# EasyEDA Pro project 2025NUEDC_A_Project.eprj, board PCB1_2
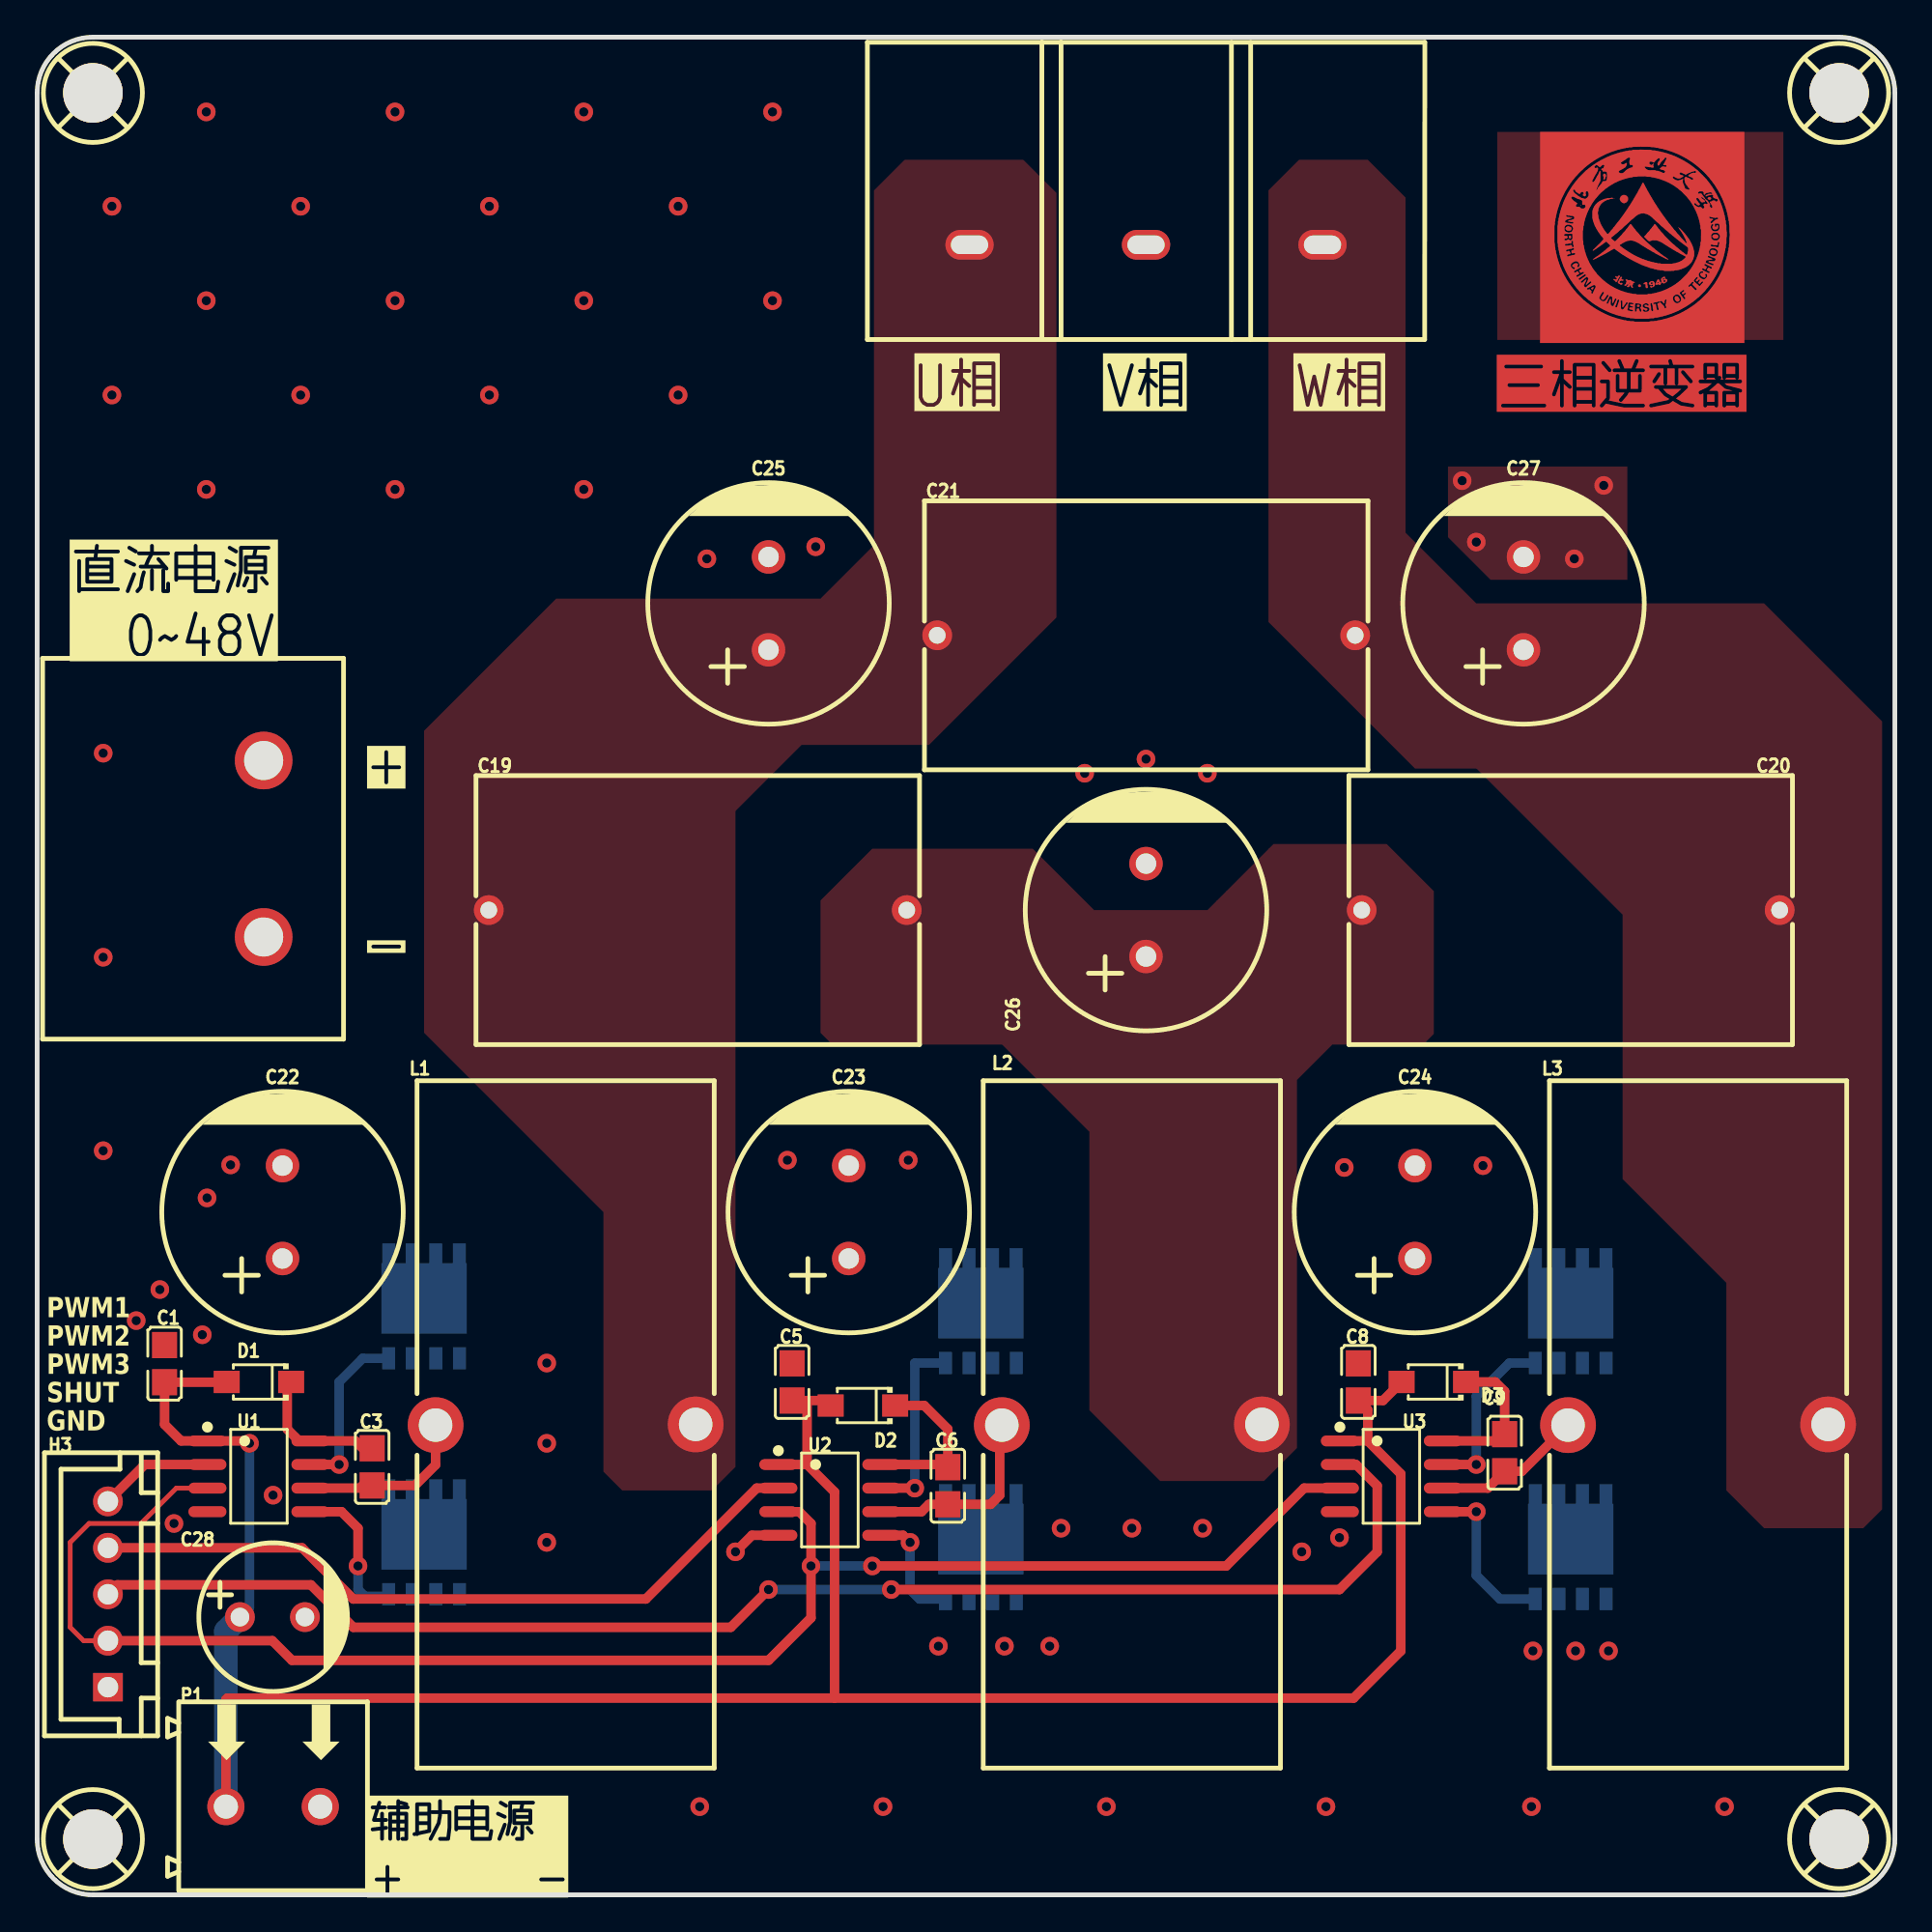
[diagram p5: board, top side]
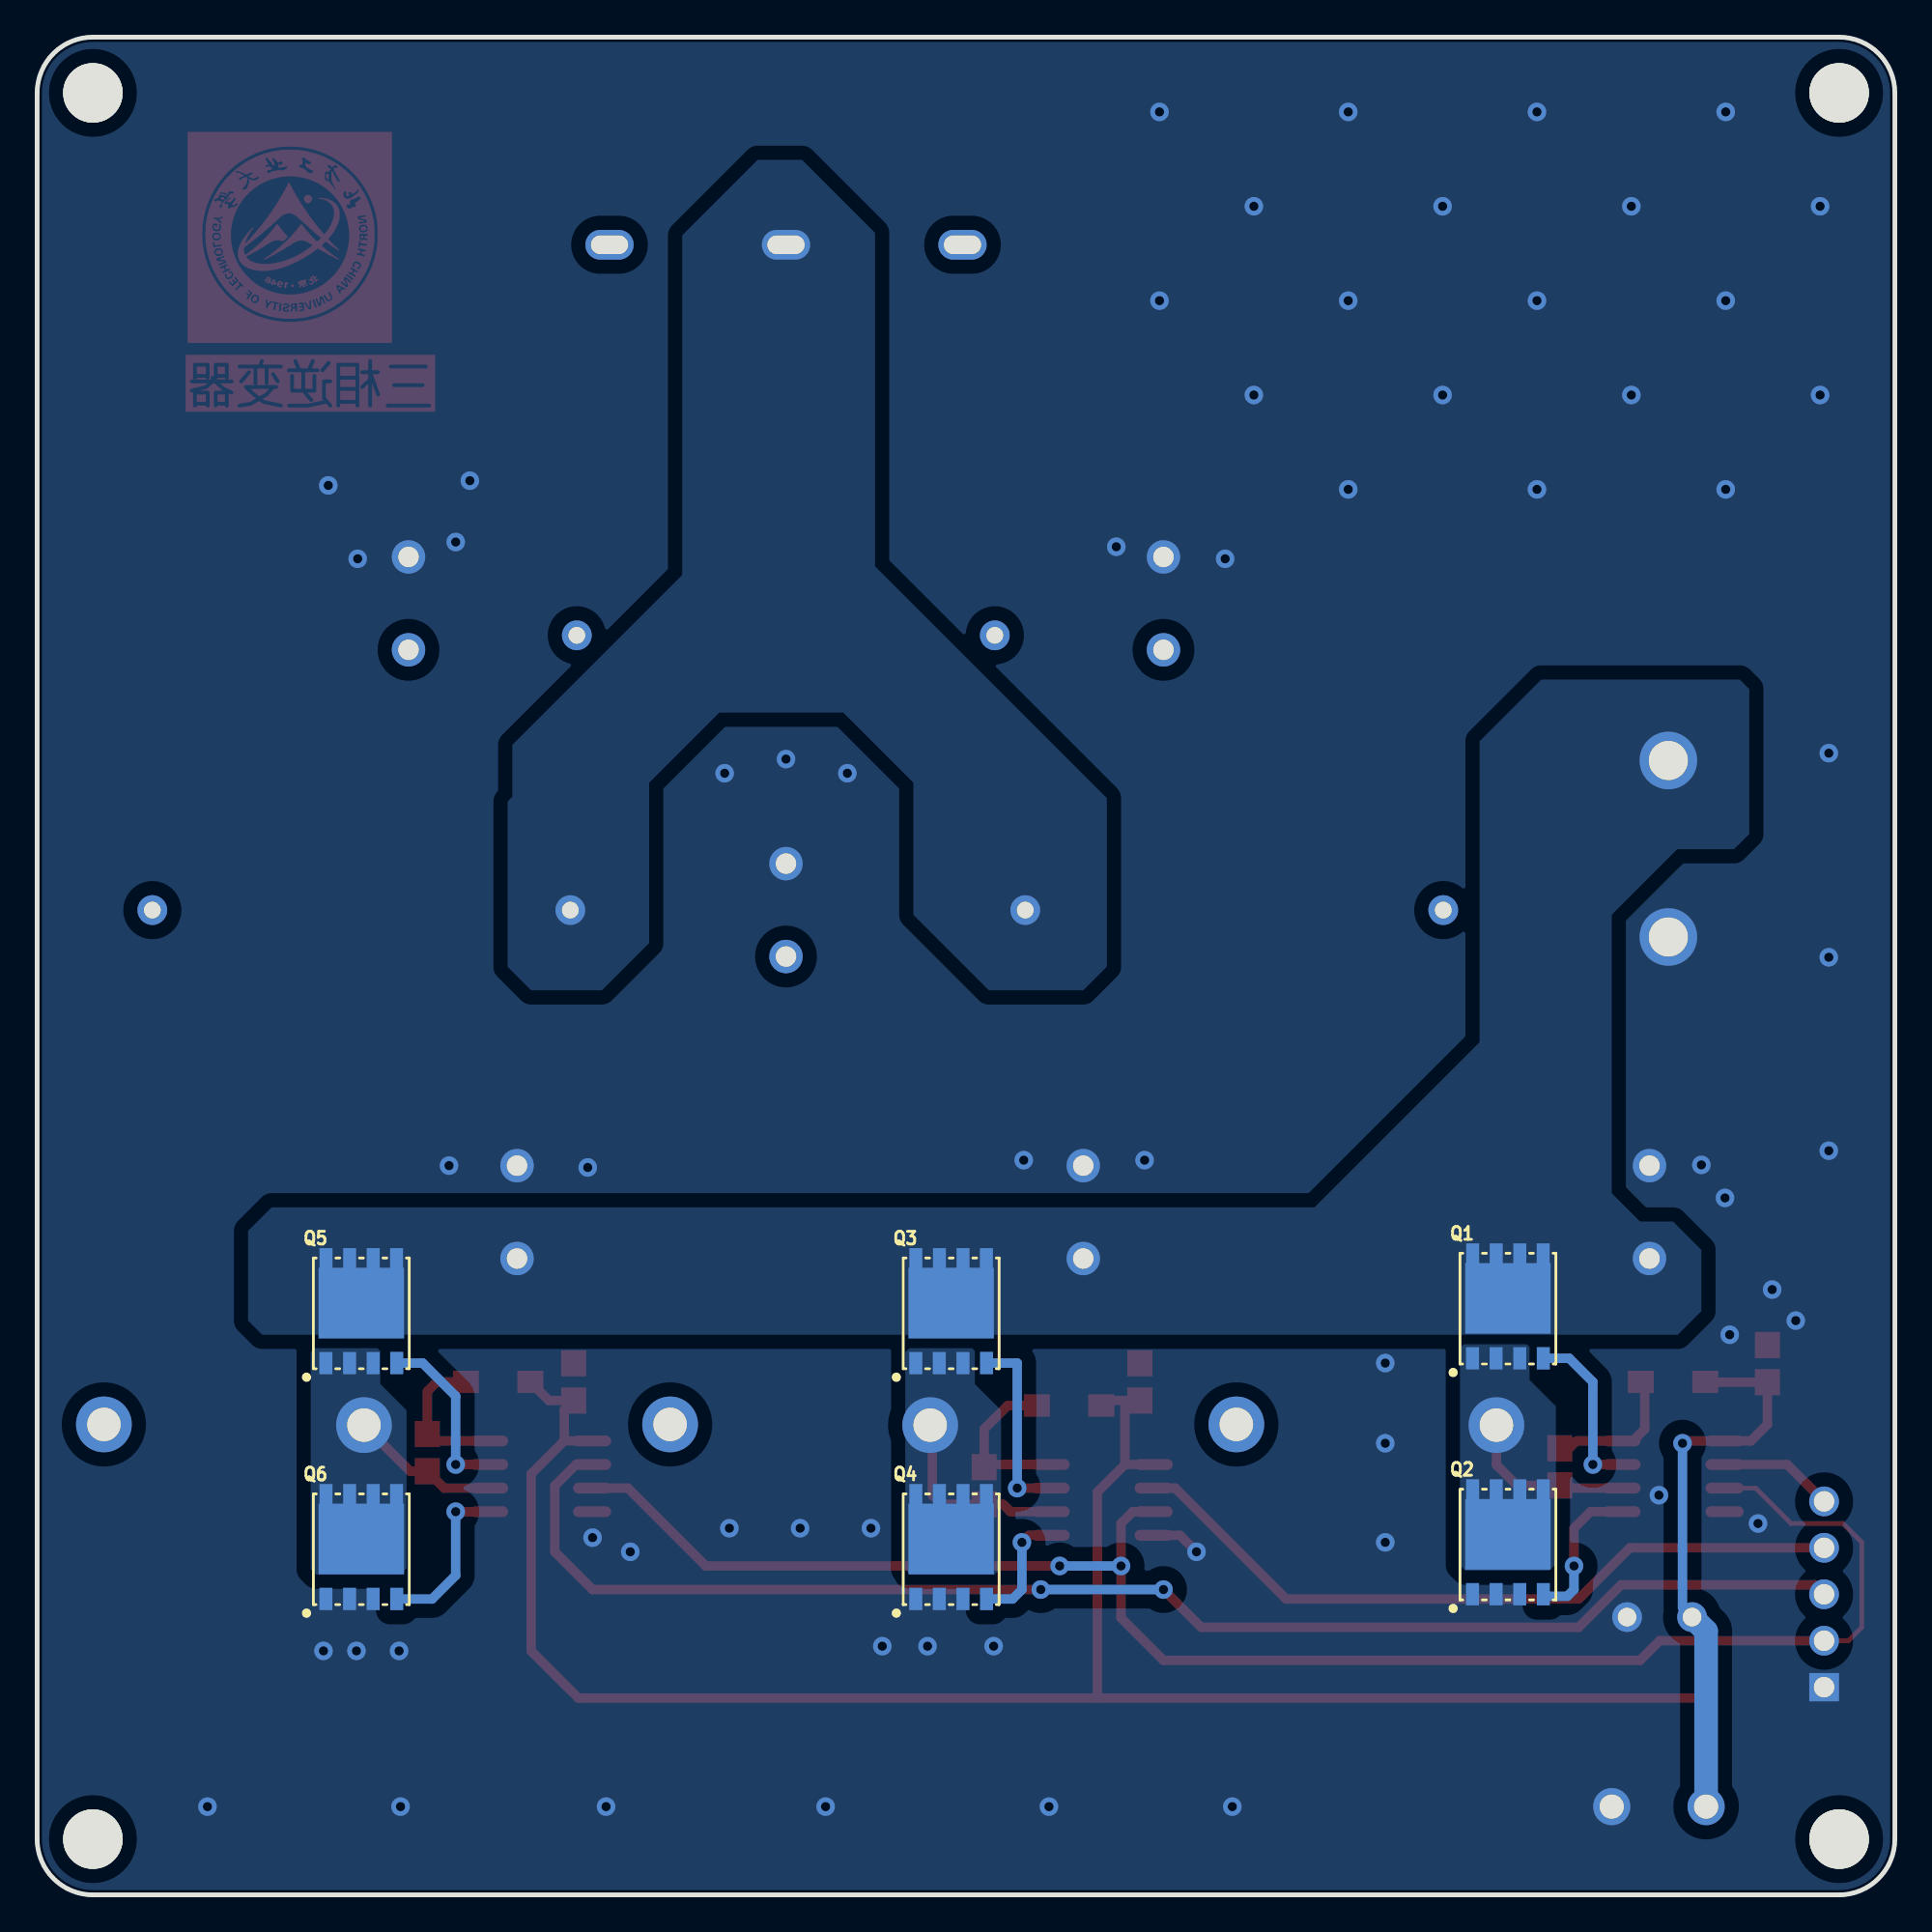
[diagram p6: board, bottom side, seen from below]

Outline 100 x 100 mm; copper layers: Top Layer, Bottom Layer. Coordinates in mm from the lower left corner of the outline.
Outline path: 0,97 0,3 arc(0.88,0.88) 3,0 97,0 arc(99.12,0.88) 100,3 100,97 arc(99.12,99.12) 97,100 3,100 arc(0.88,99.12) 0,97
Stack: Top Layer 0.035mm / Dielectric1 1.51mm FR4 er 4.5 / Bottom Layer 0.035mm

## Design rules (mm)
template: 自定义配置
spacing copperThickness1oz (default): track to track 0.102, other pairs 0 to 0.3
spacing copperThickness2oz: track to track 0.203, other pairs 0.152 to 0.3
track width copperThickness1oz (default): min 0.127, default 0.254, max 2.54
track width copperThickness2oz: min 0.203, default 0.254, max 2.54
differential pair differentialPair (default): width min 0.127, default 0.254, max 2.54; gap min 0.152, default 0.152
via viaSize (default): diameter min 0.5, default 0.61, max 10; hole min 0.3, default 0.305, max 6.299
net GND uses copperRegion1
net V uses copperRegion1

## Placement (name value [footprint] x y rotation side)
C1  10uF  [C0805]  6.86 28.59 270 top
C3  10uF  [C0805]  18.03 23.04 90 top
C5  10uF  [C0805]  40.64 27.61 270 top
C6  10uF  [C0805]  49.02 22.02 90 top
C8  10uF  [C0805]  71.12 27.61 270 top
C9  10uF  [C0805]  78.99 23.8 90 top
C19  4.7uF  [CAP-TH_L24.0-W14.5-P22.5-D0.8]  35.56 53.01 180 top
C20  4.7uF  [CAP-TH_L24.0-W14.5-P22.5-D0.8]  82.55 53.01 180 top
C21  4.7uF  [CAP-TH_L24.0-W14.5-P22.5-D0.8]  59.7 67.8 180 top
C22  470uF  [CAP-TH_BD13.0-P5.00-D0.6-FD]  13.21 36.75 90 top
C23  470uF  [CAP-TH_BD13.0-P5.00-D0.6-FD]  43.69 36.75 90 top
C24  470uF  [CAP-TH_BD13.0-P5.00-D0.6-FD]  74.17 36.75 90 top
C25  470uF  [CAP-TH_BD13.0-P5.00-D0.6-FD]  39.37 69.52 90 top
C26  470uF  [CAP-TH_BD13.0-P5.00-D0.6-FD]  59.69 53.01 90 top
C27  470uF  [CAP-TH_BD13.0-P5.00-D0.6-FD]  80.01 69.52 90 top
C28  220uF  [CAP-TH_BD8.0-P3.50-D0.6-FD]  12.67 14.95 0 top
D1  1N4007W  [SOD-123FL_L2.7-W1.8-LS3.8-RD]  11.94 27.61 180 top
D2  1N4007W  [SOD-123FL_L2.7-W1.8-LS3.8-RD]  44.45 26.34 180 top
D3  1N4007W  [SOD-123FL_L2.7-W1.8-LS3.8-RD]  75.18 27.61 180 top
H1  DBT50G-9.5-3P-BK-P OGC  [CONN-TH_3P-P9.50_DBT50G-9.5-3P]  59.69 88.82 180 top
H2  DBT50G-9.5-2P-BK-P OGC  [CONN-TH_2P-P9.50_DBT50G-9.5-2P]  12.19 56.31 270 top
H3  ZX-XH2.54-5PZZ  [CONN-TH_5P-P2.50_ZX-XH2.54-5PZZ]  3.81 16.18 90 top
L1  470uH  [IND-TH_L33.0-W16.0-P17.00-D1.5]  28.45 25.32 0 top
L2  470uH  [IND-TH_L33.0-W16.0-P17.00-D1.5]  58.93 25.32 0 top
L3  470uH  [IND-TH_L33.0-W16.0-P17.00-D1.5]  89.41 25.32 0 top
P1  WJ500V-5.08-2P  [CONN-TH_2P-P5.00_WJ500V-5.08-2P]  12.7 4.75 0 top
Q1  CJAC13TH06  [PDFN-8_L5.8-W4.9-P1.27-LS6.1-BL]  20.83 31.67 180 bottom
Q2  CJAC13TH06  [PDFN-8_L5.8-W4.9-P1.27-LS6.1-BL]  20.83 18.97 180 bottom
Q3  CJAC13TH06  [PDFN-8_L5.8-W4.9-P1.27-LS6.1-BL]  50.8 31.42 180 bottom
Q4  CJAC13TH06  [PDFN-8_L5.8-W4.9-P1.27-LS6.1-BL]  50.8 18.72 180 bottom
Q5  CJAC13TH06  [PDFN-8_L5.8-W4.9-P1.27-LS6.1-BL]  82.55 31.42 180 bottom
Q6  CJAC13TH06  [PDFN-8_L5.8-W4.9-P1.27-LS6.1-BL]  82.55 18.72 180 bottom
SCREW1  -  [M3螺丝]  3 97 0 top
SCREW2  -  [M3螺丝]  97 97 0 top
SCREW3  -  [M3螺丝]  97 3 0 top
SCREW4  -  [M3螺丝]  3 3 0 top
U1  IR2104STRPBF  [SOIC-8_L4.9-W3.9-P1.27-LS6.0-BL]  11.94 22.53 270 top
U2  IR2104STRPBF  [SOIC-8_L4.9-W3.9-P1.27-LS6.0-BL]  42.67 21.26 270 top
U3  IR2104STRPBF  [SOIC-8_L4.9-W3.9-P1.27-LS6.0-BL]  72.9 22.53 270 top

## Footprints (pads in the part's own frame, mm; a bottom-side part is the same pattern mirrored in y, then rotated)
C0805
  rect 1.41x1.35 smd: 1(-1,0) 2(1,0)
CAP-TH_BD8.0-P3.50-D0.6-FD
  round 1.6 hole 1: 1(-1.75,0) 2(1.75,0)
CAP-TH_BD13.0-P5.00-D0.6-FD
  round 1.8 hole 1.1: 1(-2.5,0) 2(2.5,0)
CAP-TH_L24.0-W14.5-P22.5-D0.8
  round 1.6 hole 0.9: 1(-11.25,0) 2(11.25,0)
CONN-TH_2P-P5.00_WJ500V-5.08-2P
  round 2 hole 1.3: 1(-2.54,0) 2(2.54,0)
CONN-TH_2P-P9.50_DBT50G-9.5-2P
  round 3.1 hole 2.1: 1(-4.75,0) 2(4.75,0)
CONN-TH_3P-P9.50_DBT50G-9.5-3P
  oval 2.6x1.6 hole 2x1: 1(-9.5,0) 2(0,0) 3(9.5,0)
CONN-TH_5P-P2.50_ZX-XH2.54-5PZZ
  rect 1.524x1.6 hole 1.1: 1(-5,0)
  round 1.6 hole 1.1: 2(-2.5,0) 3(0,0) 4(2.5,0) 5(5,0)
IND-TH_L33.0-W16.0-P17.00-D1.5
  round 3 hole 1.8: 1(-7,-0.038) 2(7,0)
M3螺丝
  round 3.2 hole 3.2: 1(0,0)
PDFN-8_L5.8-W4.9-P1.27-LS6.1-BL
  rect 0.7x1.2 smd: 1(-1.905,-2.792) 2(-0.635,-2.792) 3(0.635,-2.792) 4(1.905,-2.792) 5(1.9,2.792) 6(0.64,2.792) 7(-0.63,2.792) 8(-1.9,2.792)
  rect 4.6x3.8 smd: 9(0,0.432)
SOD-123FL_L2.7-W1.8-LS3.8-RD
  rect 1.4x1.2 smd: 1(-1.735,0) 2(1.735,0)
SOIC-8_L4.9-W3.9-P1.27-LS6.0-BL
  oval 0.588x2.045 smd: 1(-1.905,-2.772) 2(-0.635,-2.772) 3(0.635,-2.772) 4(1.905,-2.772) 5(1.905,2.772) 6(0.635,2.772) 7(-0.635,2.772) 8(-1.905,2.772)

## Nets
As in the schematic.

Pads without a net: SCREW1 1; SCREW2 1; SCREW3 1; SCREW4 1

## Via types
v1: diameter 1, hole 0.5, Top Layer to Bottom Layer, 74 vias

## Routing (per net, layer and track width the routed paths; a pad name or vN(x,y) marks a point on that pad's centre or on a via; arc(x,y) is an arc through that point)
GND: length 2.7
  Top Layer w0.508: v1(37.59,18.47) 38.48,19.35 U2.4
  vias: v1(3.56,61.46) v1(3.56,50.47) v1(3.56,40.06) v1(4.02,90.9) v1(4.02,80.74) v1(5.33,30.91) v1(6.6,32.58) v1(7.37,19.99) v1(8.89,30.15) v1(9.1,95.98) v1(9.1,85.82) v1(9.1,75.66) v1(9.14,37.52) v1(10.41,39.29) v1(12.7,21.51) v1(14.18,90.9) v1(14.18,80.74) v1(19.26,95.98) v1(19.26,85.82) v1(19.26,75.66) v1(24.34,90.9) v1(24.34,80.74) v1(27.43,28.63) v1(27.43,24.31) v1(27.43,18.97) v1(29.42,95.98) v1(29.42,85.82) v1(29.42,75.66) v1(34.5,90.9) v1(34.5,80.74) v1(35.66,4.75) v1(36.05,71.92) v1(39.58,95.98) v1(39.58,85.82) v1(40.39,39.55) v1(41.91,72.57) v1(45.53,4.75) v1(46.89,39.55) v1(48.51,13.39) v1(52.07,13.39) v1(54.51,13.39) v1(55.12,19.74) v1(56.39,60.38) v1(57.56,4.75) v1(58.93,19.74) v1(59.69,61.14) v1(62.74,19.74) v1(62.99,60.38) v1(68.07,18.47) v1(69.38,4.75) v1(70.1,19.23) v1(70.36,39.15) v1(76.71,76.12) v1(77.47,72.82) v1(77.83,39.25) v1(80.44,4.75) v1(80.52,13.13) v1(82.75,71.92) v1(82.81,13.13) v1(84.33,75.87) v1(84.59,13.13) v1(90.83,4.75)
AUXP: length 140.6
  Top Layer w0.508: C5.2 41.51,26.61 ; 41.51,26.61 42.44,26.61 42.72,26.34 ; 41.51,26.61 41.44,26.55 41.44,23.16 ; 39.14,23.16 41.44,23.16 ; 41.44,23.16 42.93,21.68 42.93,10.59 ; v1(11.43,24.31) 11.3,24.44 U1.1 7.75,24.44 6.86,25.32 C1.2 10.19,27.59 D1.2 ; 42.93,10.59 70.87,10.59 73.41,13.13 73.41,22.66 71.63,24.44 ; 42.93,10.59 10.24,10.59 10.16,10.51 P1.1 ; 71.63,24.44 71.63,26.1 C8.2 72.45,26.61 D3.2 ; 71.63,24.44 U3.1
  Bottom Layer w0.508: v1(11.43,24.31) 11.43,15.47 C28.1
  Bottom Layer w1.27: P1.1 10.16,14.2 C28.1
BST1: length 7.1
  Top Layer w0.508: 17.53,24.04 17.13,24.44 U1.8 14.1,24.44 13.46,25.07 13.46,27.4 D1.1
BST2: length 9
  Top Layer w0.508: U2.8 48.88,23.16 C6.2 49.02,25.07 47.75,26.34 D2.1
BST3: length 8.1
  Top Layer w0.508: U3.8 78.63,24.44 C9.2 78.99,27.1 78.49,27.61 D3.1
HO1: length 9.2
  Top Layer w0.508: U1.7 v1(16.26,23.16)
  Bottom Layer w0.508: v1(16.26,23.16) 16.26,27.61 17.53,28.88 ; 17.53,28.88 Q1.4
HO2: length 10.9
  Top Layer w0.508: 44.68,21.9 v1(47.24,21.9)
  Bottom Layer w0.508: 48.89,28.63 47.24,28.63 v1(47.24,21.9)
HO3: length 9.4
  Top Layer w0.508: U3.7 v1(77.47,23.16)
  Bottom Layer w0.508: v1(77.47,23.16) 77.47,26.85 79.25,28.63 80.64,28.63
LO1: length 8.1
  Top Layer w0.508: U1.5 16.38,20.62 17.27,19.74 v1(17.27,17.7)
  Bottom Layer w0.508: Q2.4 18.82,16.07 17.63,16.07 17.27,16.43 v1(17.27,17.7)
LO2: length 7.1
  Top Layer w0.508: 44.68,19.35 46.61,19.35 v1(46.99,18.97)
  Bottom Layer w0.508: 48.89,15.93 47.5,15.93 46.99,16.43 v1(46.99,18.97)
LO3: length 8.9
  Top Layer w0.508: U3.5 v1(77.47,20.62)
  Bottom Layer w0.508: 80.64,15.93 78.74,15.93 77.47,17.2 v1(77.47,20.62)
PWM1: length 6.2
  Top Layer w0.508: U1.2 5.8,23.16 H3.5
PWM2: length 39.7
  Top Layer w0.508: H3.4 14.26,18.68 17.02,15.93 32.77,15.93 38.74,21.9 39.9,21.9
PWM3: length 77.2
  Top Layer w0.508: v1(45.97,16.43) 70.1,16.43 72.14,18.47 72.14,22.02 70.99,23.16 U3.2 ; H3.3 4.32,16.69 14.73,16.69 17.02,14.4 37.34,14.4 v1(39.37,16.43)
  Bottom Layer w0.508: v1(39.37,16.43) v1(45.97,16.43)
SD: length 92
  Top Layer w0.254: H3.2 2.5,13.68 1.78,14.4 1.78,18.97 2.79,19.99 5.59,19.99 7.49,21.9 U1.3
  Top Layer w0.508: H3.2 12.66,13.68 13.72,12.62 39.37,12.62 41.66,14.91 v1(41.66,17.7) 41.66,19.99 41.02,20.62 U2.3 ; v1(44.96,17.7) 64.01,17.7 68.2,21.9 U3.3
  Bottom Layer w0.508: v1(44.96,17.7) v1(41.66,17.7)
SW1: length 9.4
  Top Layer w0.508: U1.6 17.38,21.9 17.53,22.04 20.34,22.04 21.45,23.15 L1.1
SW2: length 11.3
  Top Layer w0.508: L2.1 51.82,25.17 51.82,21.51 51.32,21.02 C6.1 48.01,21.02 47.61,20.62 44.68,20.62
SW3: length 8.1
  Top Layer w0.508: L3.1 79.92,22.8 C9.1 78.09,21.9 U3.6

## Copper pours and planes (outline as drawn; the poured copper is in the pictures)
GND on Top Layer: 75.95,76.89 85.6,76.89 85.6,70.79 75.95,70.79
GND on Top Layer: -13.97,116.26 133.35,116.26 133.35,-22.94 -13.97,-22.94
GND on Bottom Layer: -5.59,107.62 123.7,107.62 123.7,-26.49 -5.59,-26.49
VIN on Bottom Layer: 7.84,65.42 88.65,65.42 88.65,30.15 7.84,30.15
(no net) on Top Layer: 78.6,94.9 80.9,94.9 80.9,83.7 78.6,83.7
(no net) on Top Layer: 91.7,94.9 94,94.9 94,83.7 91.7,83.7
SW1 on Bottom Layer: 18.25,29.64 23.41,29.64 23.41,17.45 18.25,17.45
SW2 on Bottom Layer: 48.11,29.43 53.27,29.43 53.27,17.23 48.11,17.23
SW3 on Bottom Layer: 80.11,29.43 85.27,29.43 85.27,17.23 80.11,17.23
U on Top Layer: 20.83,93.4 54.86,93.4 54.86,21.77 20.83,21.77
V on Top Layer: 42.16,56.57 75.18,56.57 75.18,22.28 42.16,22.28
V on Bottom Layer: 42.42,93.4 74.68,93.4 74.68,48.69 42.42,48.69
W on Top Layer: 66.28,93.4 99.31,93.4 99.31,19.74 66.28,19.74

Small or netless copper shapes (teardrops, artwork), in the pictures only: 24 on Top Layer

## Text on the board
Top Layer: 三相逆变器
Top Solder Mask Layer: 三相逆变器
Top Silkscreen Layer: + | - | 直流电源 / 0~48V | PWM1 | PWM2 | PWM3 | SHUT | GND | 辅助电源 / +      - | U相 | V相 | W相
